# EAGLE design untitled (EAGLE 7.2.0)
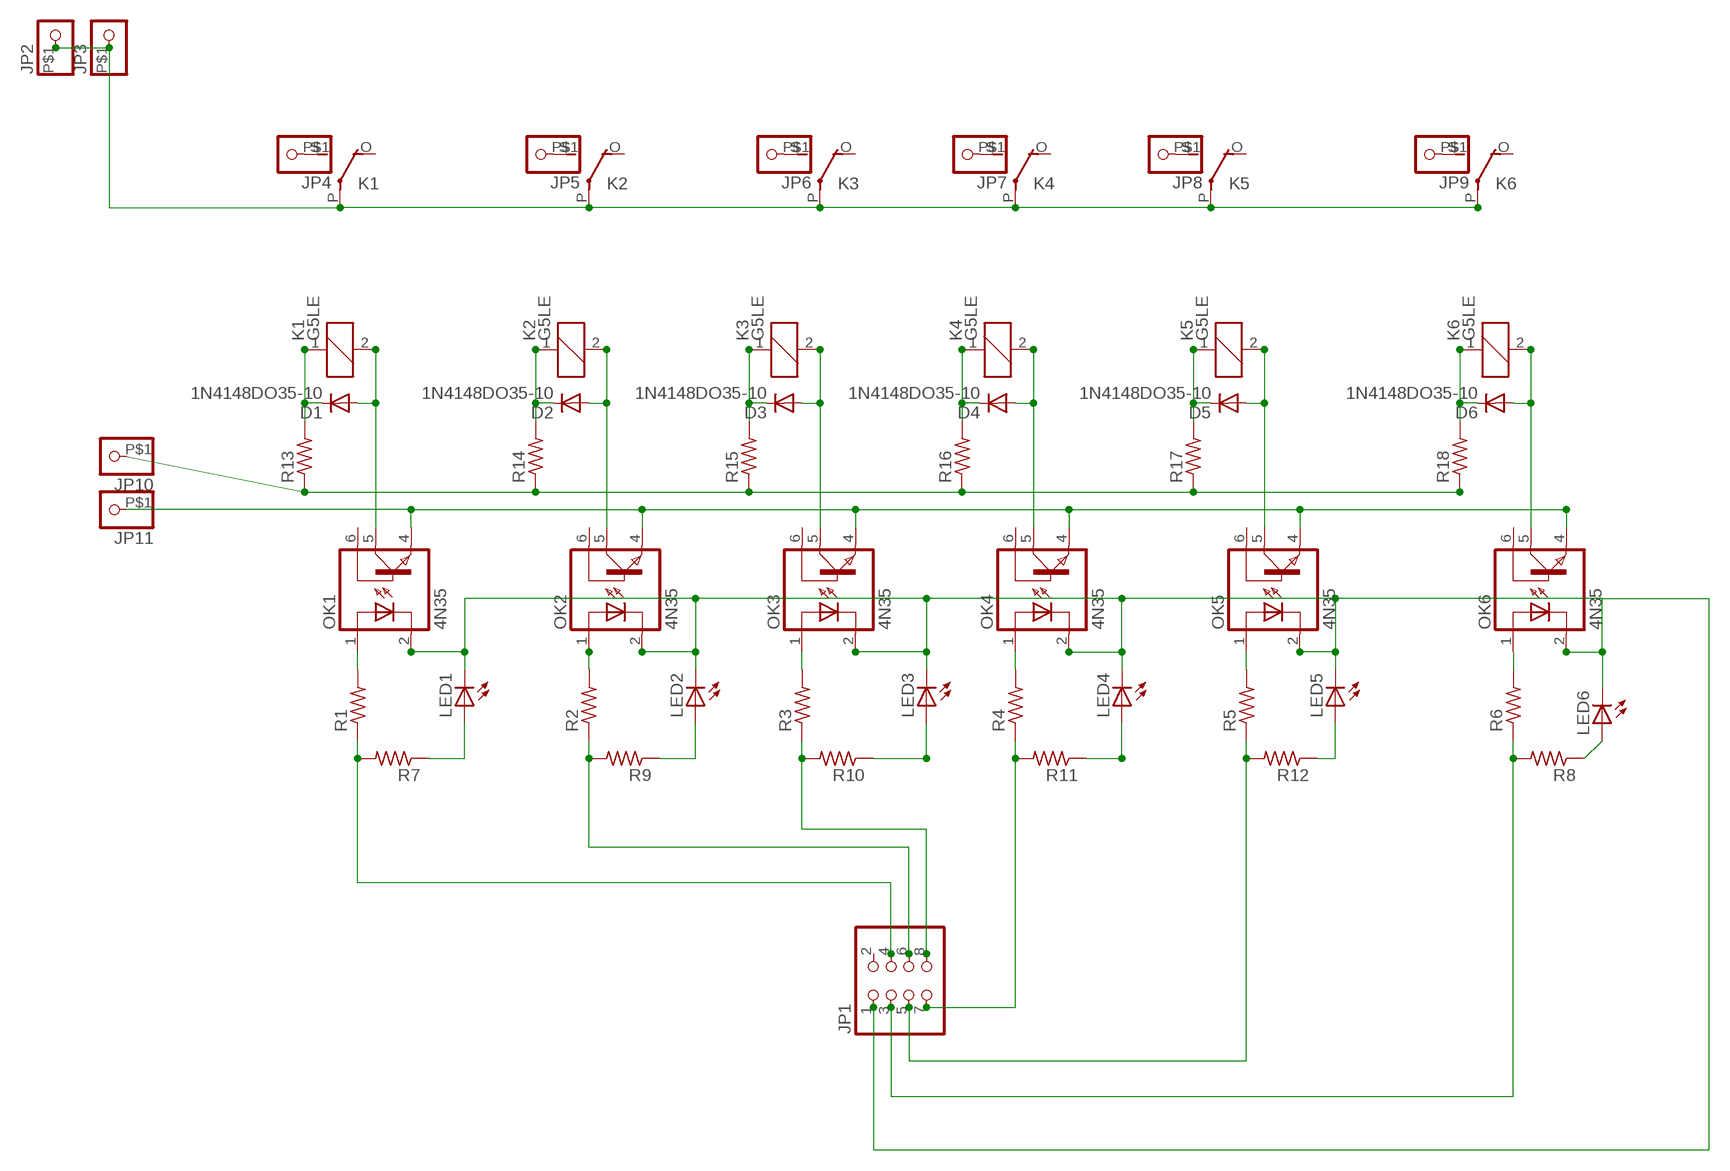
[diagram p0: schematic, sheet 1]

## Parts
D1  1N4148DO35-10  [DO35-10]
D2  1N4148DO35-10  [DO35-10]
D3  1N4148DO35-10  [DO35-10]
D4  1N4148DO35-10  [DO35-10]
D5  1N4148DO35-10  [DO35-10]
D6  1N4148DO35-10  [DO35-10]
JP1  PINHD-2X4  [2X04]
JP2  PINHD-1X1-BIGPOGO  [1X1-BIGPOGO]
JP3  PINHD-1X1-BIGPOGO  [1X1-BIGPOGO]
JP4  PINHD-1X1-BIGPOGO  [1X1-BIGPOGO]
JP5  PINHD-1X1-BIGPOGO  [1X1-BIGPOGO]
JP6  PINHD-1X1-BIGPOGO  [1X1-BIGPOGO]
JP7  PINHD-1X1-BIGPOGO  [1X1-BIGPOGO]
JP8  PINHD-1X1-BIGPOGO  [1X1-BIGPOGO]
JP9  PINHD-1X1-BIGPOGO  [1X1-BIGPOGO]
JP10  PINHD-1X1-BIGPOGO  [1X1-BIGPOGO]
JP11  PINHD-1X1-BIGPOGO  [1X1-BIGPOGO]
K1  G5LE  [G5LE]
K2  G5LE  [G5LE]
K3  G5LE  [G5LE]
K4  G5LE  [G5LE]
K5  G5LE  [G5LE]
K6  G5LE  [G5LE]
LED1  LED3MM  [LED3MM]
LED2  LED3MM  [LED3MM]
LED3  LED3MM  [LED3MM]
LED4  LED3MM  [LED3MM]
LED5  LED3MM  [LED3MM]
LED6  LED3MM  [LED3MM]
OK1  4N35  [DIL06]
OK2  4N35  [DIL06]
OK3  4N35  [DIL06]
OK4  4N35  [DIL06]
OK5  4N35  [DIL06]
OK6  4N35  [DIL06]
R1  R-US_0204/7  [0204/7]
R2  R-US_0204/7  [0204/7]
R3  R-US_0204/7  [0204/7]
R4  R-US_0204/7  [0204/7]
R5  R-US_0204/7  [0204/7]
R6  R-US_0204/7  [0204/7]
R7  R-US_0204/7  [0204/7]
R8  R-US_0204/7  [0204/7]
R9  R-US_0204/7  [0204/7]
R10  R-US_0204/7  [0204/7]
R11  R-US_0204/7  [0204/7]
R12  R-US_0204/7  [0204/7]
R13  R-US_0204/7  [0204/7]
R14  R-US_0204/7  [0204/7]
R15  R-US_0204/7  [0204/7]
R16  R-US_0204/7  [0204/7]
R17  R-US_0204/7  [0204/7]
R18  R-US_0204/7  [0204/7]

## Nets
N$1: OK1.1(A) R1.2
N$2: OK2.1(A) R2.2
N$3: OK3.1(A) R3.2
N$4: OK4.1(A) R4.2
N$5: OK5.1(A) R5.2
N$6: JP1.4 R1.1 R7.2
N$7: JP1.6 R2.1 R9.2
N$8: JP1.8 R3.1 R10.2
N$9: JP1.7 R4.1 R11.2
N$10: JP1.5 R5.1 R12.2
N$11: JP1.3 R6.1 R8.2
N$12: JP1.1 LED1.K(C) LED2.K(C) LED3.K(C) LED4.K(C) LED5.K(C) LED6.K(C) OK1.2(C) OK2.2(C) OK3.2(C) OK4.2(C) OK5.2(C) OK6.2(C)
N$13: OK6.1(A) R6.2
N$15: LED6.A R8.1
N$16: LED1.A R7.1
N$17: LED2.A R9.1
N$18: LED3.A R10.1
N$19: LED4.A R11.1
N$20: LED5.A R12.1
N$21: D6.A K6.2 OK6.5(COL)
N$22: D5.A K5.2 OK5.5(COL)
N$23: D4.A K4.2 OK4.5(COL)
N$24: D3.A K3.2 OK3.5(COL)
N$25: D2.A K2.2 OK2.5(COL)
N$26: D1.A K1.2 OK1.5(COL)
N$27: D1.C K1.1 R13.2
N$29: D2.C K2.1 R14.2
N$30: D3.C K3.1 R15.2
N$31: D4.C K4.1 R16.2
N$32: D5.C K5.1 R17.2
N$33: D6.C K6.1 R18.2
N$34: JP2.P$1 JP3.P$1 K1.P(2:P) K2.P(2:P) K3.P(2:P) K4.P(2:P) K5.P(2:P) K6.P(2:P)
N$35: JP4.P$1 K1.S(2:S)
N$36: JP10.P$1 R13.1 R14.1 R15.1 R16.1 R17.1 R18.1
N$37: JP6.P$1 K3.S(2:S)
N$38: JP5.P$1 K2.S(2:S)
N$39: JP11.P$1 OK1.4(EMI) OK2.4(EMI) OK3.4(EMI) OK4.4(EMI) OK5.4(EMI) OK6.4(EMI)
N$42: JP7.P$1 K4.S(2:S)
N$43: JP8.P$1 K5.S(2:S)
N$44: JP9.P$1 K6.S(2:S)
Unconnected: JP1.2 K1.O(2:O) K2.O(2:O) K3.O(2:O) K4.O(2:O) K5.O(2:O) K6.O(2:O) OK1.6(BAS) OK2.6(BAS) OK3.6(BAS) OK4.6(BAS) OK5.6(BAS) OK6.6(BAS)

## Library data of the parts
D1-D6 = diode:1N4148: DIODE high speed (Philips)
JP1 = adafruit:PINHD-2X4: PIN HEADER
JP2-JP11 = adafruit:PINHD-1X1: Pin header 1x1 for 0.1" spacing With round pins
K1-K6 = relay:G5LE: RELAY 1 x switch, 10 A/120 V AC, 8 A/30 V DC, Omron; OC_FARNELL: unknown; OC_NEWARK: unknown
LED1-LED6 = adafruit:LED: LED OSRAM: - CHIPLED LG R971, LG N971, LY N971, LG Q971, LY Q971, LO R971, LY R971 LH N974, LH R974 LS Q976, LO Q976, LY Q976 LO Q996 - Hyper CHIPLED LW Q18S LB Q993, LB Q99A, LB R99A - SideLED LS A670, LO A670, LY A670, LG A670, LP A670 LB A673, LV A673, LT A673, LW A673 LH A674 LY A675 LS A676, LA A676, LO A676, LY A676, LW A676 LS A679, LY A679, LG A679 - Hyper Micro SIDELED® LS Y876, LA Y876, LO Y876, LY Y876 LT Y87S - SmartLED LW L88C, LW L88S LB L89C, LB L89S, LG L890 LS L89K, LO L89K, LY L89K LS L896, LA L896, LO L896, LY L896 - TOPLED LS T670, LO T670, LY T670, LG T670, LP T670 LSG T670, LSP T670, LSY T670, LOP T670, LYG T670 LG T671, LOG T671, LSG T671 LB T673, LV T673, LT T673, LW T673 LH T674 LS T676, LA T676, LO T676, LY T676, LB T676, LH T676, LSB T676, LW T676 LB T67C, LV T67C, LT T67C, LS T67K, LO T67K, LY T67K, LW E67C LS E67B, LA E67B, LO E67B, LY E67B, LB E67C, LV E67C, LT E67C LW T67C LS T679, LY T679, LG T679 LS T770, LO T770, LY T770, LG T770, LP T770 LB T773, LV T773, LT T773, LW T773 LH T774 LS E675, LA E675, LY E675, LS T675 LS T776, LA T776, LO T776, LY T776, LB T776 LHGB T686 LT T68C, LB T68C - Hyper Mini TOPLED® LB M676 - Mini TOPLED Santana® LG M470 LS M47K, LO M47K, LY M47K Source: http://www.osram.convergy.de/
OK1-OK6 = optocoupler:4N35: MOTOROLA OPTO COUPLER; MF: FAIRCHILD SEMICONDUCTOR; MPN: 4N35; OC_FARNELL: 1328375; OC_NEWARK: 72K9946
R1-R18 = adafruit:R-US_: RESISTOR, American symbol

## Board
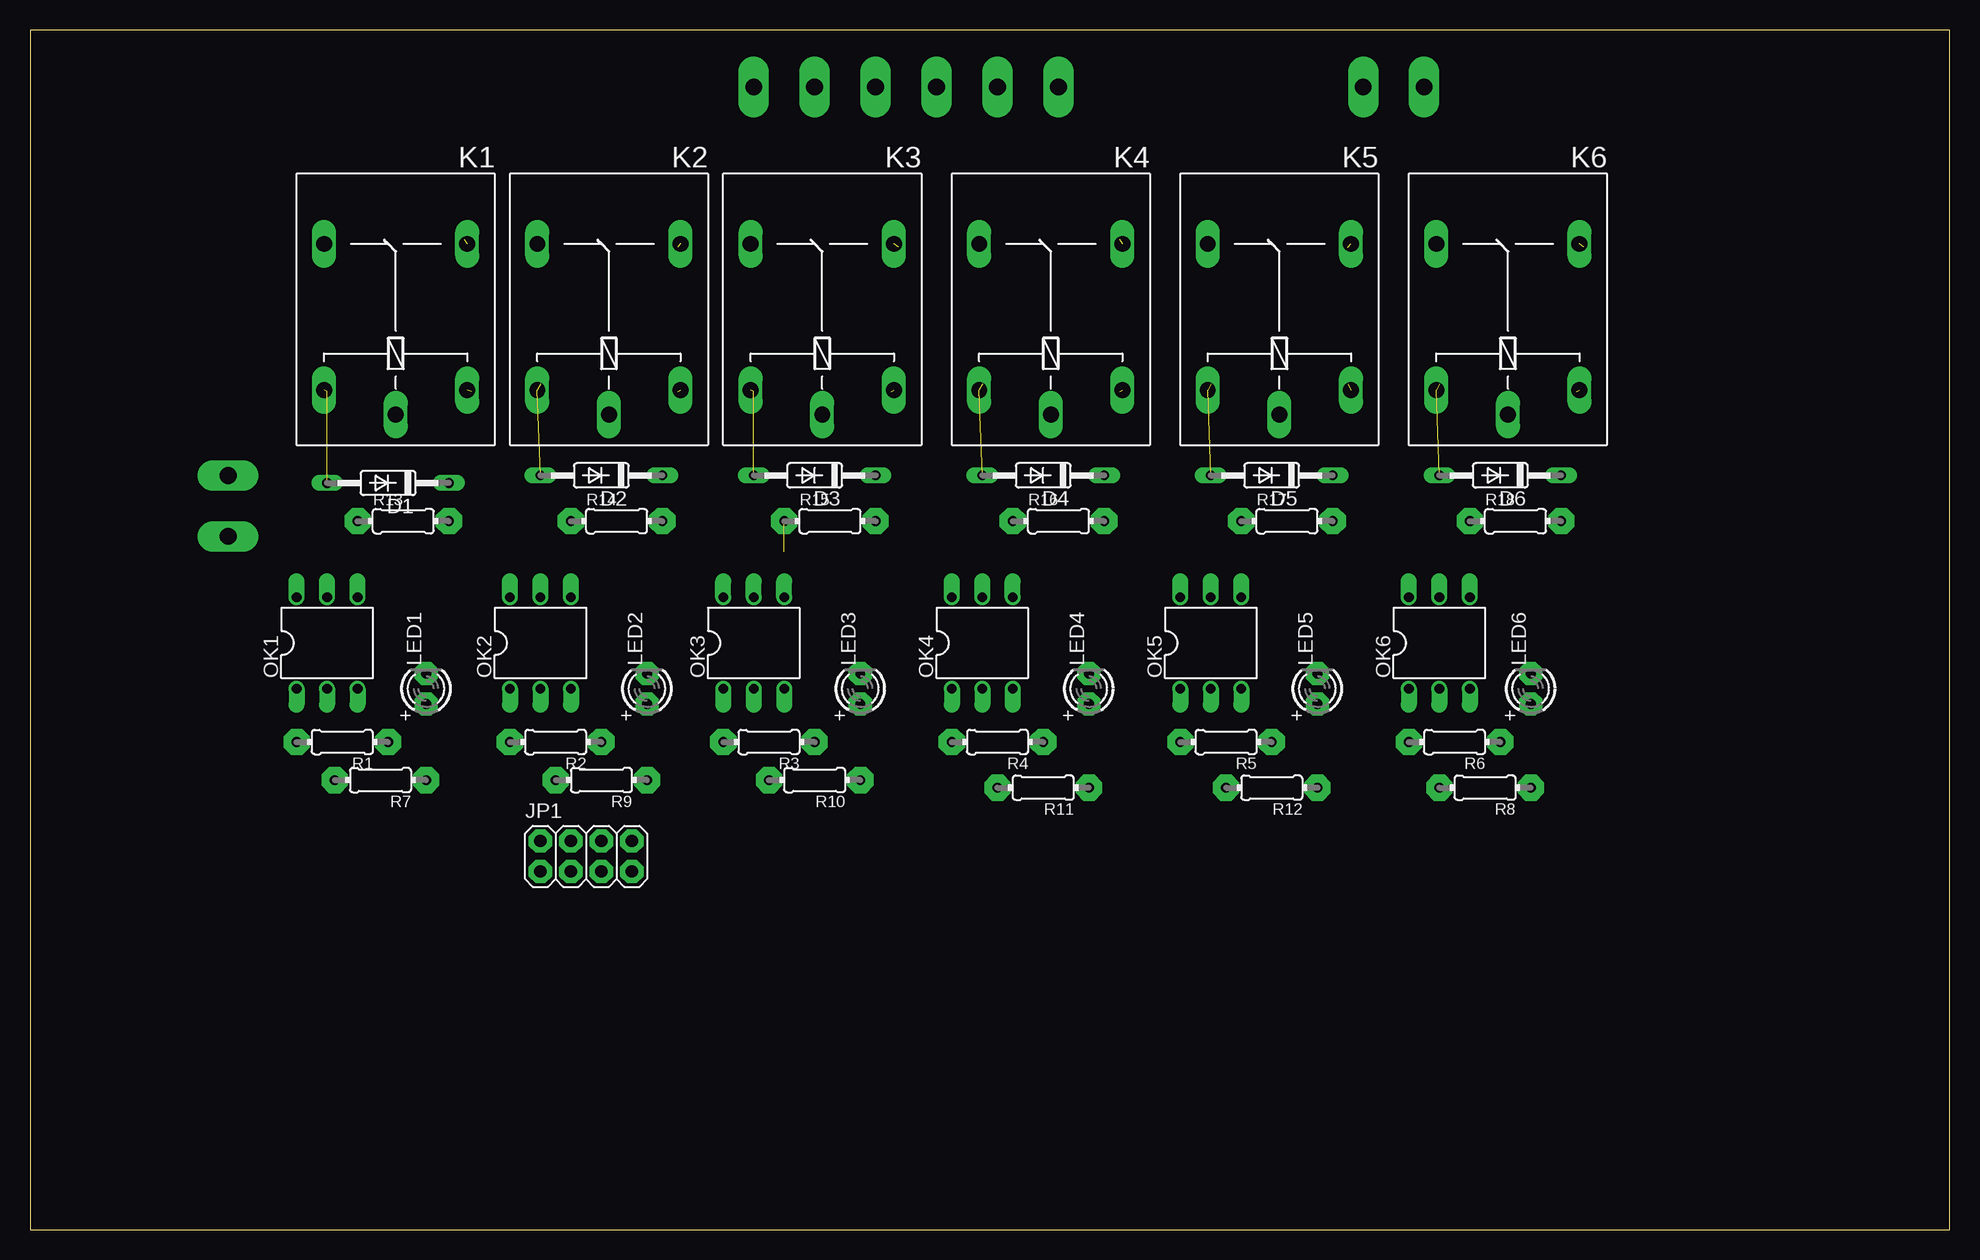
[diagram p1: board, top side]
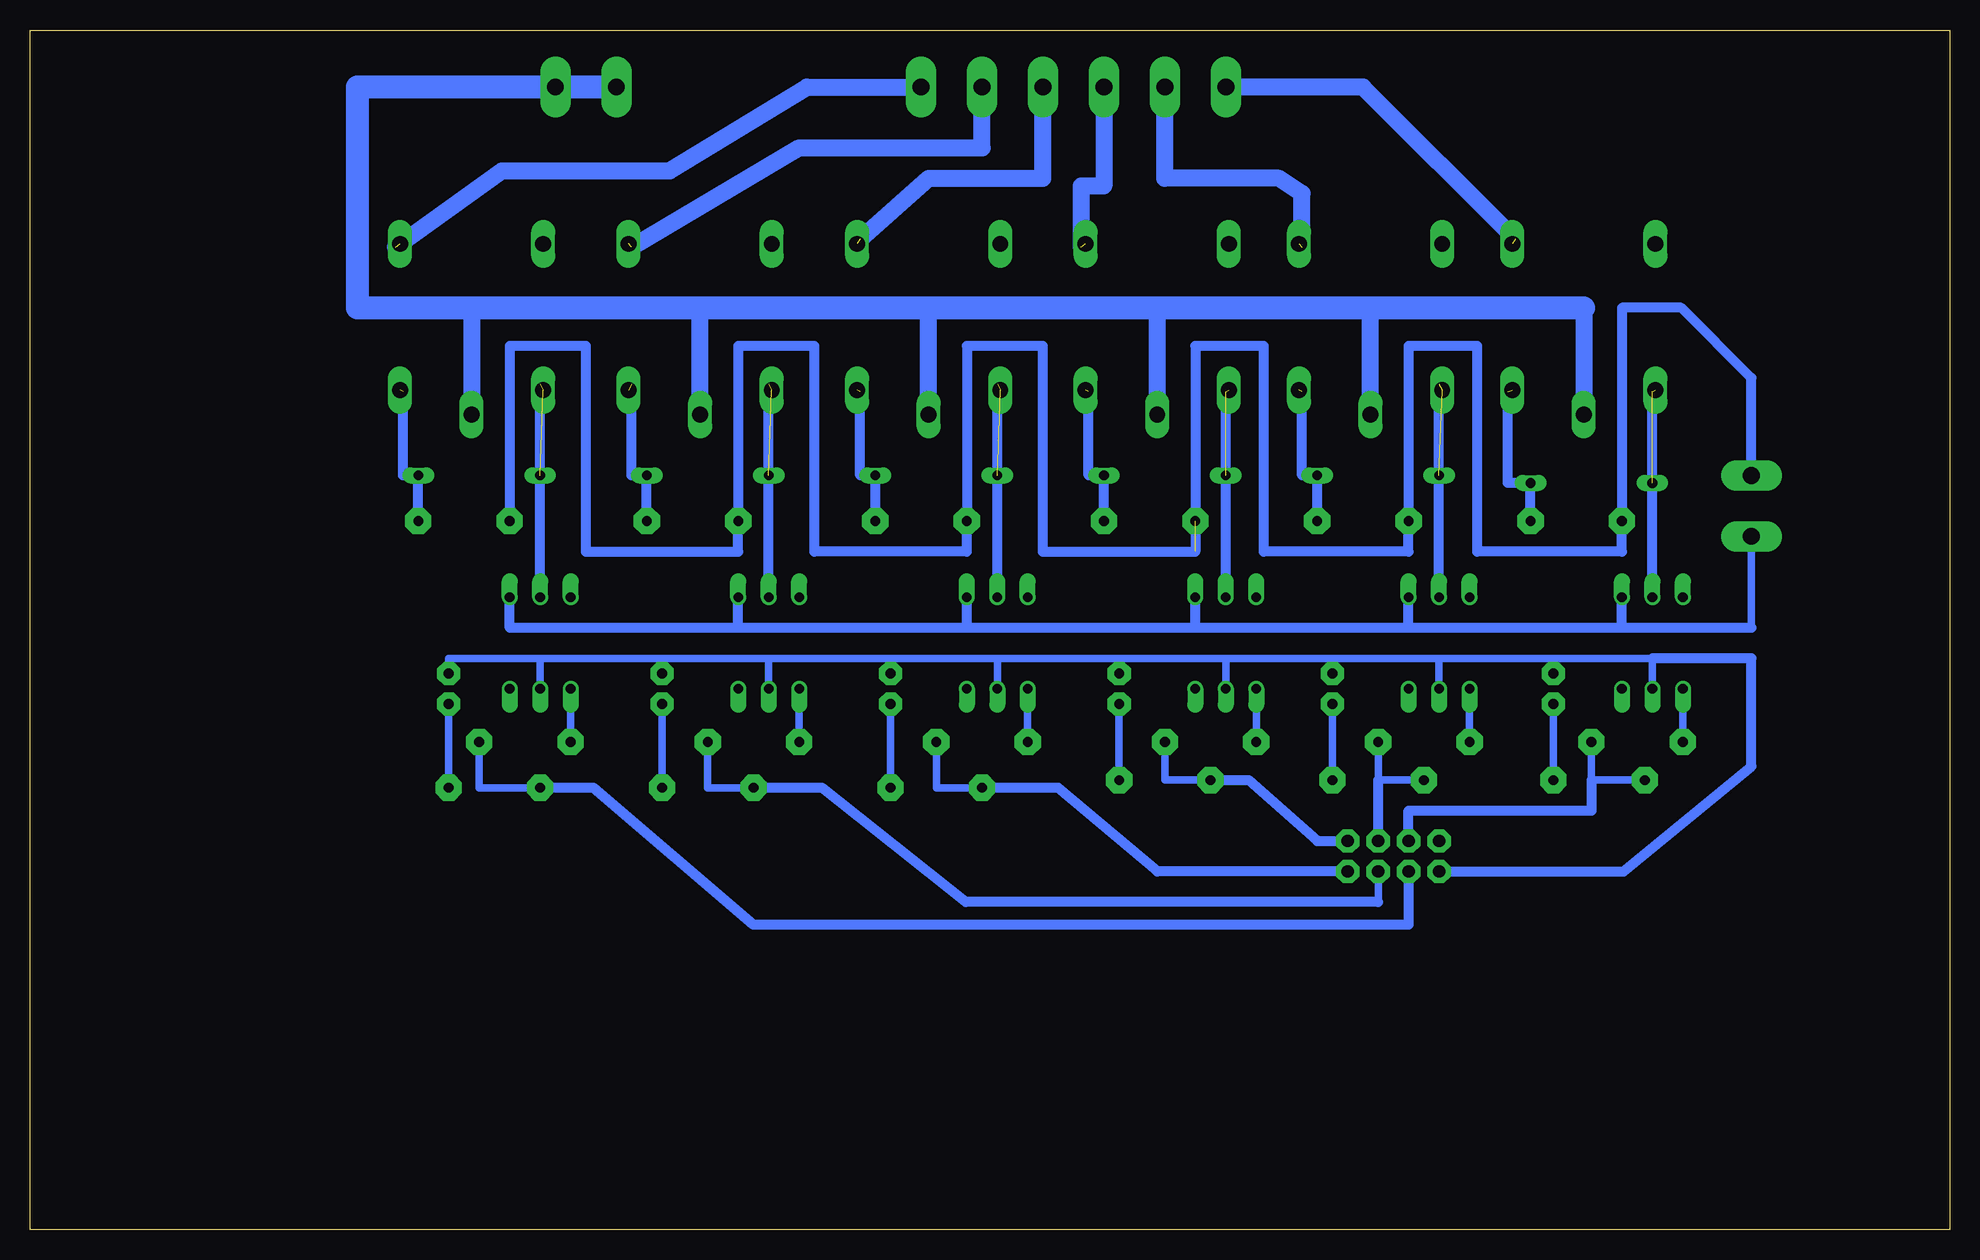
[diagram p2: board, bottom side, seen from below]

Size 160 x 100 mm. Coordinates in mm from the lower left corner, seen from the top.
Outline: 0,0 160,0 160,100 0,100 0,0
Copper layers (1*16): Top 0.035mm / dielectric 1.5mm / Bottom 0.035mm
Design rules "default *": minimum track width 10mil, minimum drill 24mil, track to track 8mil, track to pad 8mil, pad to pad 8mil, via to via 8mil, smd to smd 8mil, copper to edge 40mil, drill to drill 8mil, minimum pad ring 10mil, minimum via ring 8mil, stop-mask expansion 4mil, vias tented up to drill 0mil, thermal gap 10mil

### Footprints (pad centres in the part's own frame; a part is rotated, then mirrored left to right if it is on the bottom)
DO35-10 = drill 0.813 long: A 5.08,0; C -5.08,0
2X04 = drill 1.016 pad 1.93 octagon: 1 -3.81,-1.27; 2 -3.81,1.27; 3 -1.27,-1.27; 4 -1.27,1.27; 5 1.27,-1.27; 6 1.27,1.27; 7 3.81,-1.27; 8 3.81,1.27
1X1-BIGPOGO = drill 1.4 pad 2.54 long: P$1 0,0
G5LE = drill 1.321 long: 1 -7.493,-5.969; 2 -7.493,5.969; O 4.699,5.969; P -9.525,0; S 4.699,-5.969
LED3MM = drill 0.813 pad 1.93 octagon: A -1.27,0; K 1.27,0
DIL06 = drill 0.813 offset: 1 -2.54,-3.81; 2 0,-3.81; 3 2.54,-3.81; 4 2.54,3.81; 5 0,3.81; 6 -2.54,3.81
0204/7 = drill 0.813 pad 2.184 octagon: 1 -3.81,0; 2 3.81,0

### Placement (x,y rotation side)
D1  29.84,62.23 180 top
D2  47.62,62.87 180 top
D3  65.41,62.87 180 top
D4  84.45,62.87 180 top
D5  103.5,62.87 180 top
D6  122.56,62.87 180 top
JP1  46.35,31.11 0 top
JP2  116.2,95.25 90 top
JP3  111.12,95.25 90 top
JP4  60.33,95.25 90 top
JP5  65.41,95.25 90 top
JP6  70.48,95.25 90 top
JP7  75.56,95.25 90 top
JP8  80.64,95.25 90 top
JP9  85.72,95.25 90 top
JP10  16.51,62.87 0 top
JP11  16.51,57.78 0 top
K1  30.48,77.47 90 top
K2  48.26,77.47 90 top
K3  66.04,77.47 90 top
K4  85.09,77.47 90 top
K5  104.14,77.47 90 top
K6  123.19,77.47 90 top
LED1  33.02,45.09 90 top
LED2  51.44,45.09 90 top
LED3  69.22,45.09 90 top
LED4  88.27,45.09 90 top
LED5  107.31,45.09 90 top
LED6  125.09,45.09 90 top
OK1  24.77,48.9 0 top
OK2  42.55,48.9 0 top
OK3  60.33,48.9 0 top
OK4  79.38,48.9 0 top
OK5  98.42,48.9 0 top
OK6  117.47,48.9 0 top
R1  26.04,40.64 180 top
R2  43.81,40.64 180 top
R3  61.59,40.64 180 top
R4  80.64,40.64 180 top
R5  99.69,40.64 180 top
R6  118.75,40.64 180 top
R7  29.21,37.47 180 top
R8  121.28,36.83 180 top
R9  47.62,37.47 180 top
R10  65.41,37.47 180 top
R11  84.45,36.83 180 top
R12  103.5,36.83 180 top
R13  31.11,59.05 0 top
R14  48.9,59.05 0 top
R15  66.67,59.05 0 top
R16  85.72,59.05 0 top
R17  104.78,59.05 0 top
R18  123.83,59.05 0 top

### Tracks (layer width: path | path; a pad name or v marks a point on that pad's centre or on a via)
N$1
  Bottom 0.61: R1.2 OK1.1
N$2
  Bottom 0.61: OK2.1 R2.2
N$3
  Bottom 0.61: OK3.1 R3.2
N$4
  Bottom 0.61: R4.2 OK4.1
N$5
  Bottom 0.61: R5.2 OK5.1
N$6
  Bottom 0.61: R1.1 29.84,37.47 R7.2
  Bottom 0.813: JP1.4 45.09,34.92 29.84,34.92 29.84,37.47
N$7
  Bottom 0.61: R2.1 47.62,37.47 R9.2
  Bottom 0.813: JP1.6 47.62,37.47
N$8
  Bottom 0.61: R3.1 65.41,37.47 R10.2
  Bottom 0.813: R10.2 58.42,37.47 52.7,32.38 JP1.8
N$9
  Bottom 0.61: R11.2 84.45,36.83 R4.1
  Bottom 0.813: JP1.7 66.04,29.84 74.3,36.83 R11.2
N$10
  Bottom 0.61: R5.1 103.5,36.83 R12.2 | JP1.5 47.62,27.3
  Bottom 0.813: 47.62,27.3 82.01,27.3 93.98,36.83 R12.2 99.69,36.73
N$11
  Bottom 0.61: R6.1 122.56,36.83 R8.2
  Bottom 0.813: JP1.3 45.09,25.4 99.69,25.4 113.03,36.83 R8.2
N$12
  Bottom 0.61: OK1.2 24.77,47.62 33.02,47.62 | 33.02,47.62 42.55,47.62 | 42.55,47.62 OK2.2 | 42.55,47.62 51.44,47.62 | 51.44,47.62 60.33,47.62 | 60.33,47.62 OK3.2 | 60.33,47.62 69.22,47.62 | 69.22,47.62 79.38,47.62 | 79.38,47.62 OK4.2 | 79.38,47.62 88.27,47.62 | 88.27,47.62 98.42,47.62 | 98.42,47.62 OK5.2 | 98.42,47.62 107.31,47.62 | 107.31,47.62 117.47,47.62 | 117.47,47.62 OK6.2 | LED1.K 33.02,47.62 | LED2.K 51.44,47.62 | LED3.K 69.22,47.62 | LED4.K 88.27,47.62 | LED5.K 107.31,47.62 | 117.47,47.62 125.09,47.62 LED6.K
  Bottom 0.813: JP1.1 27.18,29.84 16.51,38.62 16.51,47.62 24.77,47.62
N$13
  Bottom 0.61: R6.2 OK6.1
N$15
  Bottom 0.61: R8.1 LED6.A
N$16
  Bottom 0.61: R7.1 LED1.A
N$17
  Bottom 0.61: LED2.A R9.1
N$18
  Bottom 0.61: LED3.A R10.1
N$19
  Bottom 0.61: R11.1 LED4.A
N$20
  Bottom 0.61: R12.1 LED5.A
N$21  (2 unrouted)
  Bottom 0.813: OK6.5 117.47,70.48
N$22  (2 unrouted)
  Bottom 0.813: OK5.5 98.42,70.48
N$23  (2 unrouted)
  Bottom 0.813: OK4.5 79.38,70.48
N$24  (2 unrouted)
  Bottom 0.813: OK3.5 60.33,69.85
N$25  (2 unrouted)
  Bottom 0.813: OK2.5 42.55,70.48
N$26  (2 unrouted)
  Bottom 0.813: OK1.5 24.77,69.85
N$27  (1 unrouted)
  Bottom 0.813: R13.2 D1.C 36.83,62.23 36.83,69.85
N$29  (1 unrouted)
  Bottom 0.61: D2.C 53.98,62.87
  Bottom 0.813: R14.2 D2.C | 53.98,62.87 53.98,69.85
N$30  (1 unrouted)
  Bottom 0.61: D3.C 71.75,62.87
  Bottom 0.813: R15.2 D3.C | 71.75,62.87 71.75,69.85
N$31  (1 unrouted)
  Bottom 0.61: D4.C 90.81,62.87
  Bottom 0.813: R16.2 D4.C | 90.81,62.87 90.81,69.85
N$32  (1 unrouted)
  Bottom 0.61: D5.C 109.86,62.87
  Bottom 0.813: R17.2 D5.C | 109.86,62.87 109.86,70.48
N$33  (1 unrouted)
  Bottom 0.61: D6.C 128.91,62.87
  Bottom 0.813: R18.2 D6.C | 128.91,62.87 128.91,69.85
N$34
  Bottom 1.422: 123.19,76.83 K6.P | 30.48,76.83 K1.P | K2.P 48.26,76.83 | K3.P 66.04,76.83 | K4.P 85.09,76.83 | K5.P 104.14,76.83
  Bottom 1.93: JP3.P$1 JP2.P$1 132.72,95.25 132.72,76.83 123.19,76.83 104.14,76.83 85.09,76.83 66.04,76.83 48.26,76.83 30.48,76.83
N$35  (1 unrouted)
  Bottom 1.422: 36.2,82.55 48.9,95.25 JP4.P$1
N$36  (1 unrouted)
  Bottom 0.61: 120.02,58.42 R18.1
  Bottom 0.813: JP10.P$1 16.51,70.98 22.36,76.83 27.3,76.83 R13.1 27.3,56.52 39.37,56.52 39.37,73.66 45.09,73.66 R14.1 45.09,56.52 57.15,56.52 57.15,73.66 62.87,73.66 62.87,56.52 75.56,56.52 75.56,73.66 81.92,73.66 R16.1 81.92,56.52 94.61,56.52 94.61,73.66 100.97,73.66 R17.1 100.97,56.52 113.67,56.52 113.67,73.66 120.02,73.66 R18.1
N$37  (1 unrouted)
  Bottom 1.422: JP6.P$1 70.48,87 72.39,87 72.39,81.92
N$38  (1 unrouted)
  Bottom 1.422: 53.98,81.92 53.98,86.36 55.88,87.63 65.41,87.63 JP5.P$1
N$39
  Bottom 0.61: JP11.P$1 16.51,50.16
  Bottom 0.813: 16.51,50.16 27.3,50.16 | 27.3,50.16 OK1.4 | 27.3,50.16 45.09,50.16 | 45.09,50.16 OK2.4 | 45.09,50.16 62.87,50.16 | 62.87,50.16 OK3.4 | 62.87,50.16 81.92,50.16 | 81.92,50.16 OK4.4 | 81.92,50.16 100.97,50.16 | 100.97,50.16 OK5.4 | 100.97,50.16 120.02,50.16 OK6.4
N$42  (1 unrouted)
  Bottom 1.422: 90.81,82.55 85.09,87.63 75.56,87.63 JP7.P$1
N$43  (1 unrouted)
  Bottom 1.422: 109.86,81.92 95.89,90.17 80.64,90.17 JP8.P$1
N$44  (1 unrouted)
  Bottom 1.422: 129.54,81.92 120.65,88.27 106.68,88.27 95.25,95.25 JP9.P$1